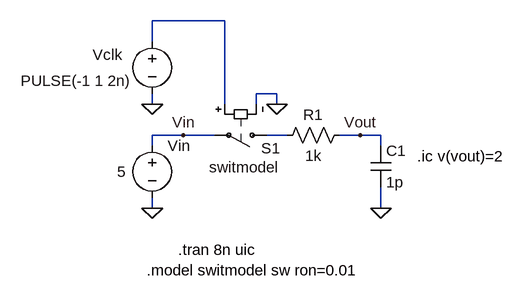
[diagram p0: schematic Fig1_30.asc]
Fig1_30.asc, the LTspice schematic file:
Version 4
SHEET 1 1048 680
WIRE 112 48 0 48
WIRE 0 80 0 48
WIRE 192 160 160 160
WIRE 0 176 0 160
WIRE 112 176 112 48
WIRE 160 176 160 160
WIRE 192 176 192 160
WIRE 48 224 0 224
WIRE 96 224 48 224
WIRE 208 224 176 224
WIRE 320 224 288 224
WIRE 352 224 320 224
WIRE 0 240 0 224
WIRE 352 240 352 224
WIRE 0 336 0 320
WIRE 352 336 352 304
FLAG 0 336 0
FLAG 352 336 0
FLAG 320 224 Vout
FLAG 48 224 Vin
FLAG 192 176 0
FLAG 0 176 0
SYMBOL voltage 0 224 R0
WINDOW 123 0 0 Left 0
WINDOW 39 0 0 Left 0
WINDOW 3 -54 56 Left 0
SYMATTR Value 5
SYMATTR InstName Vin
SYMBOL res 192 240 R270
WINDOW 0 32 56 VTop 0
WINDOW 3 0 56 VBottom 0
SYMATTR InstName R1
SYMATTR Value 1k
SYMBOL cap 336 240 R0
SYMATTR InstName C1
SYMATTR Value 1p
SYMBOL sw 192 224 R90
WINDOW 0 20 -5 VRight 0
WINDOW 3 49 -3 VRight 0
SYMATTR InstName S1
SYMATTR Value switmodel
SYMBOL voltage 0 64 R0
WINDOW 0 -91 36 Left 0
WINDOW 3 -202 76 Left 0
WINDOW 123 0 0 Left 0
WINDOW 39 0 0 Left 0
SYMATTR InstName Vclk
SYMATTR Value PULSE(-1 1 2n)
TEXT 40 400 Left 0 !.tran 8n uic
TEXT -8 432 Left 0 !.model switmodel sw ron=0.01
TEXT 408 256 Left 0 !.ic v(vout)=2

The netlist it stands for:
* Fig1_30.asc
Vin Vin 0 5
R1 N002 Vout 1k
C1 Vout 0 1p
S1 N002 Vin N001 0 switmodel
Vclk N001 0 PULSE(-1 1 2n)
.tran 8n uic
.model switmodel sw ron=0.01
.ic v(vout)=2
.backanno
.end